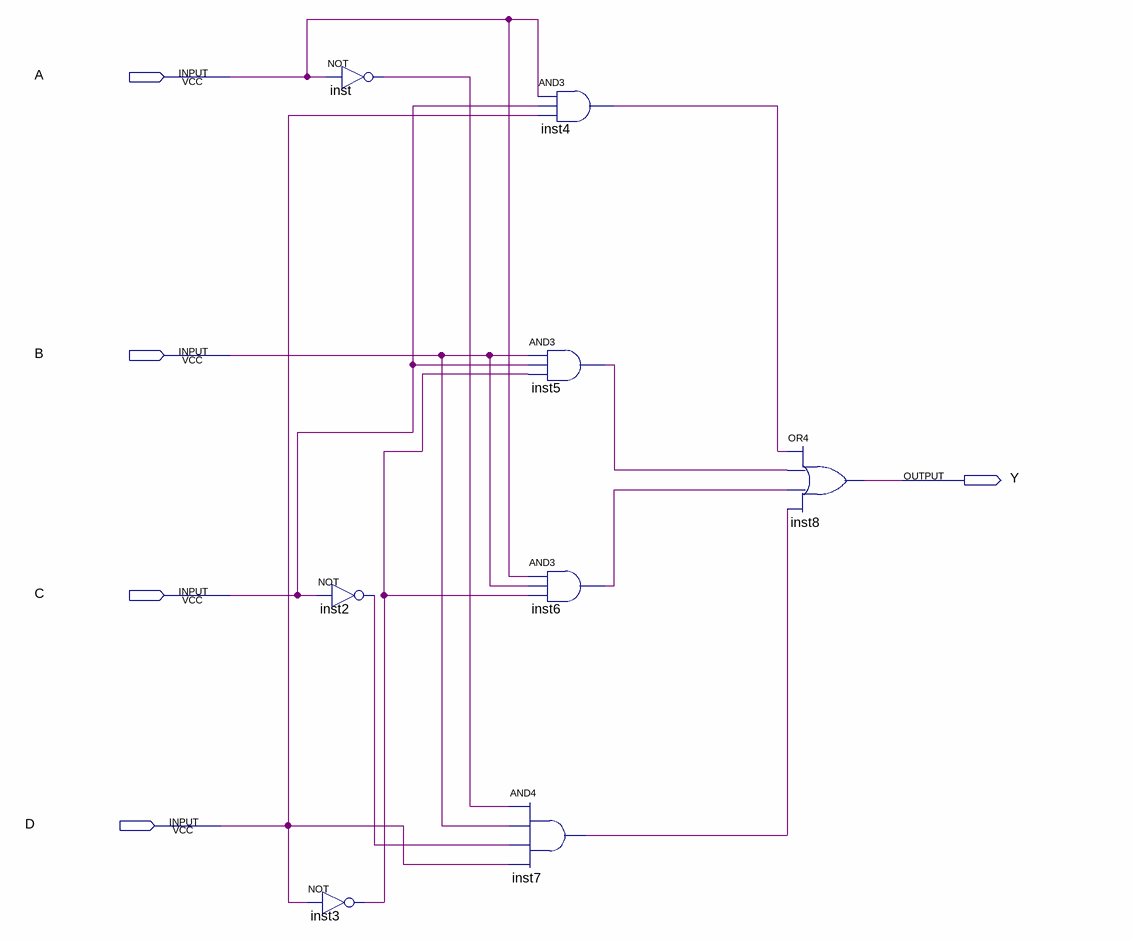
[diagram p0: schematic sheet]
// Quartus schematic segmentcircuit1.bdf as structural Verilog: 8 symbols, 5 pins
module segmentcircuit1 (
  input  A,
  input  B,
  input  C,
  input  D,
  output Y
);

  wire inst2_out, inst3_out, inst4_out, inst5_out, inst6_out, inst7_out, inst_out;

  not inst2 (inst2_out, C);
  not inst3 (inst3_out, D);
  not inst (inst_out, A);
  and inst4 (inst4_out, A, C, D);
  and inst5 (inst5_out, B, C, inst3_out);
  and inst6 (inst6_out, A, B, inst3_out);
  and inst7 (inst7_out, inst_out, B, inst2_out, D);
  or inst8 (Y, inst4_out, inst5_out, inst6_out, inst7_out);
endmodule
